# Altium schematic sheet FPGA_FMC.SchDoc
size 420 x 297 mm; EDA_Number: ARTIQ; CompanyName: WUT ISE; Organization: WUT ISE; DocumentNumber: 3; SheetNumber: 3; ModifiedBy: -; Title2: FPGA FMC; ModifiedDate: -
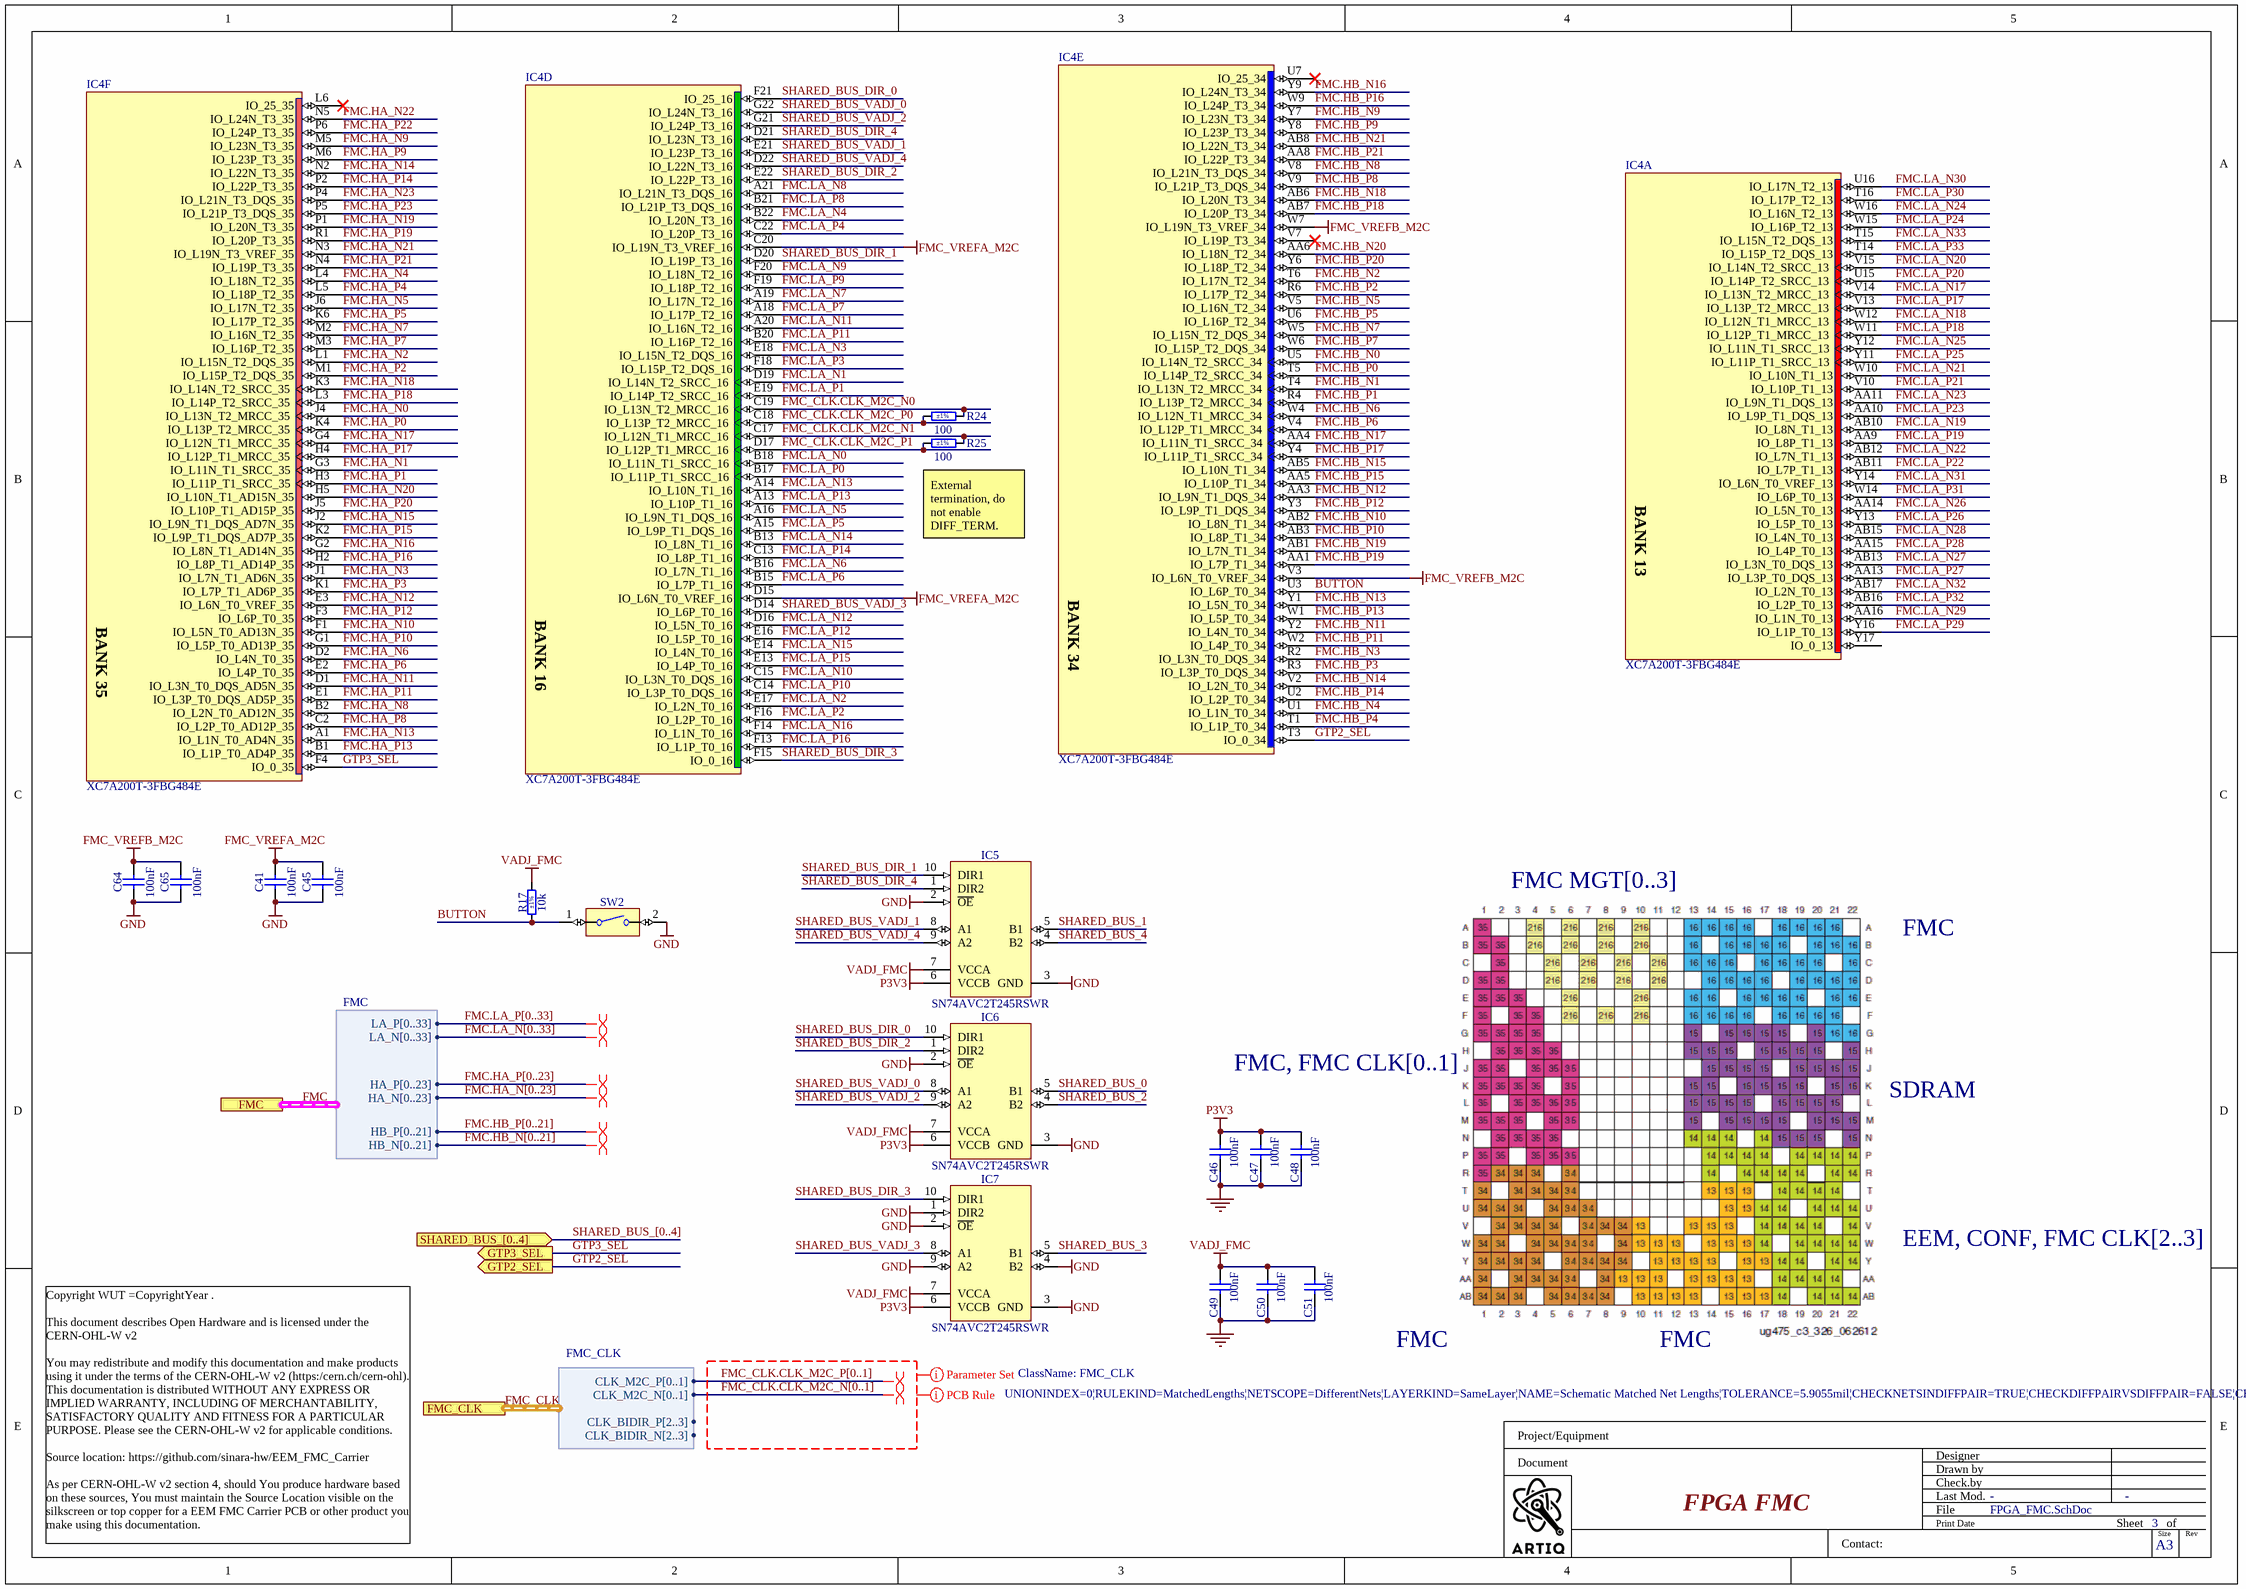
[diagram p0: FPGA_FMC.SchDoc]

## Parts
C41  100nF  [CAPC0603X33N]
C45  100nF  [CAPC0603X33N]
C46  100nF  [CAPC0603X33N]
C47  100nF  [CAPC0603X33N]
C48  100nF  [CAPC0603X33N]
C49  100nF  [CAPC0603X33N]
C50  100nF  [CAPC0603X33N]
C51  100nF  [CAPC0603X33N]
C64  100nF  [CAPC0603X33N]
C65  100nF  [CAPC0603X33N]
IC4  XC7A200T-3FBG484E  [BGA484C100P22X22_2300X2300X254]  (parts A,D,E,F of 10)
IC5  SN74AVC2T245RSWR  [QFN40P140X180X55-10N]
IC6  SN74AVC2T245RSWR  [QFN40P140X180X55-10N]
IC7  SN74AVC2T245RSWR  [QFN40P140X180X55-10N]
R17  10k  Tolerance: ±1%  [RESC1005X40N]
R24  100  Tolerance: ±1%  [RESC0603X28N]
R25  100  Tolerance: ±1%  [RESC0603X28N]
SW2  Switch  [SW_OMRON_B3U-3000PM]  (value not drawn)

## Ports
FMC (harness FMC), FMC_CLK (harness FMC_CLK), GTP2_SEL (out), GTP3_SEL (out), SHARED_BUS_[0..4] (in)

## Harnesses
FMC: LA_P[0..33], LA_N[0..33], HA_P[0..23], HA_N[0..23], HB_P[0..21], HB_N[0..21]
FMC_CLK: CLK_M2C_P[0..1], CLK_M2C_N[0..1], CLK_BIDIR_P[2..3], CLK_BIDIR_N[2..3]

## Nets
FMC_VREFA_M2C: C41.2 C45.2 IC4.C20(IO_L19N_T3_VREF_16) IC4.D15(IO_L6N_T0_VREF_16)
FMC_VREFB_M2C: C64.2 C65.2 IC4.V3(IO_L6N_T0_VREF_34) IC4.W7(IO_L19N_T3_VREF_34)
GND: C41.1 C45.1 C46.1 C47.1 C48.1 C49.1 C50.1 C51.1 C64.1 C65.1 IC5.2(~{OE}) IC5.3(GND) IC6.2(~{OE}) IC6.3(GND) IC7.1(DIR2) IC7.2(~{OE}) IC7.3(GND) IC7.4(B2) IC7.9(A2) SW2.2
P3V3: C46.2 C47.2 C48.2 IC5.6(VCCB) IC6.6(VCCB) IC7.6(VCCB)
VADJ_FMC: C49.2 C50.2 C51.2 IC5.7(VCCA) IC6.7(VCCA) IC7.7(VCCA) R17.2
BUTTON: IC4.U3(IO_L6P_T0_34) R17.1 SW2.1
FMC.HA_N0: IC4.J4(IO_L13N_T2_MRCC_35)
FMC.HA_N1: IC4.G3(IO_L11N_T1_SRCC_35)
FMC.HA_N2: IC4.L1(IO_L15N_T2_DQS_35)
FMC.HA_N3: IC4.J1(IO_L7N_T1_AD6N_35)
FMC.HA_N4: IC4.L4(IO_L18N_T2_35)
FMC.HA_N5: IC4.J6(IO_L17N_T2_35)
FMC.HA_N6: IC4.D2(IO_L4N_T0_35)
FMC.HA_N7: IC4.M2(IO_L16N_T2_35)
FMC.HA_N8: IC4.B2(IO_L2N_T0_AD12N_35)
FMC.HA_N9: IC4.M5(IO_L23N_T3_35)
FMC.HA_N10: IC4.F1(IO_L5N_T0_AD13N_35)
FMC.HA_N11: IC4.D1(IO_L3N_T0_DQS_AD5N_35)
FMC.HA_N12: IC4.E3(IO_L6N_T0_VREF_35)
FMC.HA_N13: IC4.A1(IO_L1N_T0_AD4N_35)
FMC.HA_N14: IC4.N2(IO_L22N_T3_35)
FMC.HA_N15: IC4.J2(IO_L9N_T1_DQS_AD7N_35)
FMC.HA_N16: IC4.G2(IO_L8N_T1_AD14N_35)
FMC.HA_N17: IC4.G4(IO_L12N_T1_MRCC_35)
FMC.HA_N18: IC4.K3(IO_L14N_T2_SRCC_35)
FMC.HA_N19: IC4.P1(IO_L20N_T3_35)
FMC.HA_N20: IC4.H5(IO_L10N_T1_AD15N_35)
FMC.HA_N21: IC4.N3(IO_L19N_T3_VREF_35)
FMC.HA_N22: IC4.N5(IO_L24N_T3_35)
FMC.HA_N23: IC4.P4(IO_L21N_T3_DQS_35)
FMC.HA_P0: IC4.K4(IO_L13P_T2_MRCC_35)
FMC.HA_P1: IC4.H3(IO_L11P_T1_SRCC_35)
FMC.HA_P2: IC4.M1(IO_L15P_T2_DQS_35)
FMC.HA_P3: IC4.K1(IO_L7P_T1_AD6P_35)
FMC.HA_P4: IC4.L5(IO_L18P_T2_35)
FMC.HA_P5: IC4.K6(IO_L17P_T2_35)
FMC.HA_P6: IC4.E2(IO_L4P_T0_35)
FMC.HA_P7: IC4.M3(IO_L16P_T2_35)
FMC.HA_P8: IC4.C2(IO_L2P_T0_AD12P_35)
FMC.HA_P9: IC4.M6(IO_L23P_T3_35)
FMC.HA_P10: IC4.G1(IO_L5P_T0_AD13P_35)
FMC.HA_P11: IC4.E1(IO_L3P_T0_DQS_AD5P_35)
FMC.HA_P12: IC4.F3(IO_L6P_T0_35)
FMC.HA_P13: IC4.B1(IO_L1P_T0_AD4P_35)
FMC.HA_P14: IC4.P2(IO_L22P_T3_35)
FMC.HA_P15: IC4.K2(IO_L9P_T1_DQS_AD7P_35)
FMC.HA_P16: IC4.H2(IO_L8P_T1_AD14P_35)
FMC.HA_P17: IC4.H4(IO_L12P_T1_MRCC_35)
FMC.HA_P18: IC4.L3(IO_L14P_T2_SRCC_35)
FMC.HA_P19: IC4.R1(IO_L20P_T3_35)
FMC.HA_P20: IC4.J5(IO_L10P_T1_AD15P_35)
FMC.HA_P21: IC4.N4(IO_L19P_T3_35)
FMC.HA_P22: IC4.P6(IO_L24P_T3_35)
FMC.HA_P23: IC4.P5(IO_L21P_T3_DQS_35)
FMC.HB_N0: IC4.U5(IO_L14N_T2_SRCC_34)
FMC.HB_N1: IC4.T4(IO_L13N_T2_MRCC_34)
FMC.HB_N2: IC4.T6(IO_L17N_T2_34)
FMC.HB_N3: IC4.R2(IO_L3N_T0_DQS_34)
FMC.HB_N4: IC4.U1(IO_L1N_T0_34)
FMC.HB_N5: IC4.V5(IO_L16N_T2_34)
FMC.HB_N6: IC4.W4(IO_L12N_T1_MRCC_34)
FMC.HB_N7: IC4.W5(IO_L15N_T2_DQS_34)
FMC.HB_N8: IC4.V8(IO_L21N_T3_DQS_34)
FMC.HB_N9: IC4.Y7(IO_L23N_T3_34)
FMC.HB_N10: IC4.AB2(IO_L8N_T1_34)
FMC.HB_N11: IC4.Y2(IO_L4N_T0_34)
FMC.HB_N12: IC4.AA3(IO_L9N_T1_DQS_34)
FMC.HB_N13: IC4.Y1(IO_L5N_T0_34)
FMC.HB_N14: IC4.V2(IO_L2N_T0_34)
FMC.HB_N15: IC4.AB5(IO_L10N_T1_34)
FMC.HB_N16: IC4.Y9(IO_L24N_T3_34)
FMC.HB_N17: IC4.AA4(IO_L11N_T1_SRCC_34)
FMC.HB_N18: IC4.AB6(IO_L20N_T3_34)
FMC.HB_N19: IC4.AB1(IO_L7N_T1_34)
FMC.HB_N20: IC4.AA6(IO_L18N_T2_34)
FMC.HB_N21: IC4.AB8(IO_L22N_T3_34)
FMC.HB_P0: IC4.T5(IO_L14P_T2_SRCC_34)
FMC.HB_P1: IC4.R4(IO_L13P_T2_MRCC_34)
FMC.HB_P2: IC4.R6(IO_L17P_T2_34)
FMC.HB_P3: IC4.R3(IO_L3P_T0_DQS_34)
FMC.HB_P4: IC4.T1(IO_L1P_T0_34)
FMC.HB_P5: IC4.U6(IO_L16P_T2_34)
FMC.HB_P6: IC4.V4(IO_L12P_T1_MRCC_34)
FMC.HB_P7: IC4.W6(IO_L15P_T2_DQS_34)
FMC.HB_P8: IC4.V9(IO_L21P_T3_DQS_34)
FMC.HB_P9: IC4.Y8(IO_L23P_T3_34)
FMC.HB_P10: IC4.AB3(IO_L8P_T1_34)
FMC.HB_P11: IC4.W2(IO_L4P_T0_34)
FMC.HB_P12: IC4.Y3(IO_L9P_T1_DQS_34)
FMC.HB_P13: IC4.W1(IO_L5P_T0_34)
FMC.HB_P14: IC4.U2(IO_L2P_T0_34)
FMC.HB_P15: IC4.AA5(IO_L10P_T1_34)
FMC.HB_P16: IC4.W9(IO_L24P_T3_34)
FMC.HB_P17: IC4.Y4(IO_L11P_T1_SRCC_34)
FMC.HB_P18: IC4.AB7(IO_L20P_T3_34)
FMC.HB_P19: IC4.AA1(IO_L7P_T1_34)
FMC.HB_P20: IC4.Y6(IO_L18P_T2_34)
FMC.HB_P21: IC4.AA8(IO_L22P_T3_34)
FMC.LA_N0: IC4.B18(IO_L11N_T1_SRCC_16)
FMC.LA_N1: IC4.D19(IO_L14N_T2_SRCC_16)
FMC.LA_N2: IC4.E17(IO_L2N_T0_16)
FMC.LA_N3: IC4.E18(IO_L15N_T2_DQS_16)
FMC.LA_N4: IC4.B22(IO_L20N_T3_16)
FMC.LA_N5: IC4.A16(IO_L9N_T1_DQS_16)
FMC.LA_N6: IC4.B16(IO_L7N_T1_16)
FMC.LA_N7: IC4.A19(IO_L17N_T2_16)
FMC.LA_N8: IC4.A21(IO_L21N_T3_DQS_16)
FMC.LA_N9: IC4.F20(IO_L18N_T2_16)
FMC.LA_N10: IC4.C15(IO_L3N_T0_DQS_16)
FMC.LA_N11: IC4.A20(IO_L16N_T2_16)
FMC.LA_N12: IC4.D16(IO_L5N_T0_16)
FMC.LA_N13: IC4.A14(IO_L10N_T1_16)
FMC.LA_N14: IC4.B13(IO_L8N_T1_16)
FMC.LA_N15: IC4.E14(IO_L4N_T0_16)
FMC.LA_N16: IC4.F14(IO_L1N_T0_16)
FMC.LA_N17: IC4.V14(IO_L13N_T2_MRCC_13)
FMC.LA_N18: IC4.W12(IO_L12N_T1_MRCC_13)
FMC.LA_N19: IC4.AB10(IO_L8N_T1_13)
FMC.LA_N20: IC4.V15(IO_L14N_T2_SRCC_13)
FMC.LA_N21: IC4.W10(IO_L10N_T1_13)
FMC.LA_N22: IC4.AB12(IO_L7N_T1_13)
FMC.LA_N23: IC4.AA11(IO_L9N_T1_DQS_13)
FMC.LA_N24: IC4.W16(IO_L16N_T2_13)
FMC.LA_N25: IC4.Y12(IO_L11N_T1_SRCC_13)
FMC.LA_N26: IC4.AA14(IO_L5N_T0_13)
FMC.LA_N27: IC4.AB13(IO_L3N_T0_DQS_13)
FMC.LA_N28: IC4.AB15(IO_L4N_T0_13)
FMC.LA_N29: IC4.AA16(IO_L1N_T0_13)
FMC.LA_N30: IC4.U16(IO_L17N_T2_13)
FMC.LA_N31: IC4.Y14(IO_L6N_T0_VREF_13)
FMC.LA_N32: IC4.AB17(IO_L2N_T0_13)
FMC.LA_N33: IC4.T15(IO_L15N_T2_DQS_13)
FMC.LA_P0: IC4.B17(IO_L11P_T1_SRCC_16)
FMC.LA_P1: IC4.E19(IO_L14P_T2_SRCC_16)
FMC.LA_P2: IC4.F16(IO_L2P_T0_16)
FMC.LA_P3: IC4.F18(IO_L15P_T2_DQS_16)
FMC.LA_P4: IC4.C22(IO_L20P_T3_16)
FMC.LA_P5: IC4.A15(IO_L9P_T1_DQS_16)
FMC.LA_P6: IC4.B15(IO_L7P_T1_16)
FMC.LA_P7: IC4.A18(IO_L17P_T2_16)
FMC.LA_P8: IC4.B21(IO_L21P_T3_DQS_16)
FMC.LA_P9: IC4.F19(IO_L18P_T2_16)
FMC.LA_P10: IC4.C14(IO_L3P_T0_DQS_16)
FMC.LA_P11: IC4.B20(IO_L16P_T2_16)
FMC.LA_P12: IC4.E16(IO_L5P_T0_16)
FMC.LA_P13: IC4.A13(IO_L10P_T1_16)
FMC.LA_P14: IC4.C13(IO_L8P_T1_16)
FMC.LA_P15: IC4.E13(IO_L4P_T0_16)
FMC.LA_P16: IC4.F13(IO_L1P_T0_16)
FMC.LA_P17: IC4.V13(IO_L13P_T2_MRCC_13)
FMC.LA_P18: IC4.W11(IO_L12P_T1_MRCC_13)
FMC.LA_P19: IC4.AA9(IO_L8P_T1_13)
FMC.LA_P20: IC4.U15(IO_L14P_T2_SRCC_13)
FMC.LA_P21: IC4.V10(IO_L10P_T1_13)
FMC.LA_P22: IC4.AB11(IO_L7P_T1_13)
FMC.LA_P23: IC4.AA10(IO_L9P_T1_DQS_13)
FMC.LA_P24: IC4.W15(IO_L16P_T2_13)
FMC.LA_P25: IC4.Y11(IO_L11P_T1_SRCC_13)
FMC.LA_P26: IC4.Y13(IO_L5P_T0_13)
FMC.LA_P27: IC4.AA13(IO_L3P_T0_DQS_13)
FMC.LA_P28: IC4.AA15(IO_L4P_T0_13)
FMC.LA_P29: IC4.Y16(IO_L1P_T0_13)
FMC.LA_P30: IC4.T16(IO_L17P_T2_13)
FMC.LA_P31: IC4.W14(IO_L6P_T0_13)
FMC.LA_P32: IC4.AB16(IO_L2P_T0_13)
FMC.LA_P33: IC4.T14(IO_L15P_T2_DQS_13)
FMC_CLK.CLK_M2C_N0: IC4.C19(IO_L13N_T2_MRCC_16) R24.2
FMC_CLK.CLK_M2C_N1: IC4.C17(IO_L12N_T1_MRCC_16) R25.2
FMC_CLK.CLK_M2C_P0: IC4.C18(IO_L13P_T2_MRCC_16) R24.1
FMC_CLK.CLK_M2C_P1: IC4.D17(IO_L12P_T1_MRCC_16) R25.1
GTP2_SEL: IC4.T3(IO_0_34) ; port GTP2_SEL
GTP3_SEL: IC4.F4(IO_0_35) ; port GTP3_SEL
SHARED_BUS_0: IC6.5(B1)
SHARED_BUS_1: IC5.5(B1)
SHARED_BUS_2: IC6.4(B2)
SHARED_BUS_3: IC7.5(B1)
SHARED_BUS_4: IC5.4(B2)
SHARED_BUS_DIR_0: IC4.F21(IO_25_16) IC6.10(DIR1)
SHARED_BUS_DIR_1: IC4.D20(IO_L19P_T3_16) IC5.10(DIR1)
SHARED_BUS_DIR_2: IC4.E22(IO_L22P_T3_16) IC6.1(DIR2)
SHARED_BUS_DIR_3: IC4.F15(IO_0_16) IC7.10(DIR1)
SHARED_BUS_DIR_4: IC4.D21(IO_L23N_T3_16) IC5.1(DIR2)
SHARED_BUS_VADJ_0: IC4.G22(IO_L24N_T3_16) IC6.8(A1)
SHARED_BUS_VADJ_1: IC4.E21(IO_L23P_T3_16) IC5.8(A1)
SHARED_BUS_VADJ_2: IC4.G21(IO_L24P_T3_16) IC6.9(A2)
SHARED_BUS_VADJ_3: IC4.D14(IO_L6P_T0_16) IC7.8(A1)
SHARED_BUS_VADJ_4: IC4.D22(IO_L22N_T3_16) IC5.9(A2)

Not connected (* = marked no-connect by the designer): IC4 L6(IO_25_35)* U7(IO_25_34)* V7(IO_L19P_T3_34)* Y17(IO_0_13)

## Buses and harness runs
bus FMC.HA_N[0..23]
bus FMC.HA_P[0..23]
bus FMC.HB_N[0..21]
bus FMC.HB_P[0..21]
bus FMC.LA_N[0..33]
bus FMC.LA_P[0..33]
bus FMC_CLK.CLK_M2C_N[0..1]
bus FMC_CLK.CLK_M2C_P[0..1]
bus SHARED_BUS_[0..4] = port SHARED_BUS_[0..4]
harness FMC = port FMC
harness FMC_CLK = port FMC_CLK

## Layout directives
differential pair; differential pair class FMC_LA; differential pair class Diff_100Ohm: (no net found under the mark)
differential pair; differential pair class FMC_HA; differential pair class Diff_100Ohm: (no net found under the mark)
differential pair; differential pair class FMC_HB; differential pair class Diff_100Ohm: (no net found under the mark)
net class FMC_CLK: FMC_CLK.CLK_M2C_N[0..1], FMC_CLK.CLK_M2C_P[0..1]
rule Matched Net Lengths [Delay Tolerance = 11ps]: FMC_CLK.CLK_M2C_N[0..1], FMC_CLK.CLK_M2C_P[0..1]
differential pair; differential pair class Diff_100Ohm: FMC_CLK.CLK_M2C_N[0..1], FMC_CLK.CLK_M2C_P[0..1]

## Notes on the sheet
- (near R25) External termination, do not enable DIFF_TERM.
- FMC MGT[0..3]
- FMC
- FMC, FMC CLK[0..1]
- SDRAM
- EEM, CONF, FMC CLK[2..3]
- Project/Equipment
- Document
- Designer
- Drawn by
- Check.by
- Copyright WUT =CopyrightYear .
  This document describes Open Hardware and is licensed under the CERN-OHL-W v2
  You may redistribute and modify this documentation and make products using it under the terms of the CERN-OHL-W v2 (https:/cern.ch/cern-ohl). This documentation is distributed WITHOUT ANY EXPRESS OR IMPLIED WARRANTY, INCLUDING OF MERCHANTABILITY, SATISFACTORY QUALITY AND FITNESS FOR A PARTICULAR PURPOSE. Please see the CERN-OHL-W v2 for applicable conditions.
  Source location: https://github.com/sinara-hw/EEM_FMC_Carrier
  As per CERN-OHL-W v2 section 4, should You produce hardware based on these sources, You must maintain the Source Location visible on the silkscreen or top copper for a EEM FMC Carrier PCB or other product you make using this documentation.
- Contact:
- File
- Last Mod.
- Print Date
- Sheet
- Size
- A3
- of
- Rev
- (in symbol XC7A200T-3FBG484E, part A) BANK 13
- (in symbol XC7A200T-3FBG484E, part D) BANK 16
- (in symbol XC7A200T-3FBG484E, part E) BANK 34
- (in symbol XC7A200T-3FBG484E, part F) BANK 35

## Library data of the parts
C41 C45 C64 C65 = CC0201_100NF_6.3V_10%_X5R: Non-polarised capacitor; Part Description: SMD Multilayer Chip Ceramic Capacitor; Manufacturer: GENERIC; Manufacturer1 Part Number: 02016D104KAT2A; Voltage: 6.3V; TC: X5R; Tolerance: ±10%; Table: Capacitors SMD; Part Number: CC0201_100NF_6.3V_10%_X5R; Component Kind: Standard; Component Type: Standard; Pin Count: 2; Value: 100nF; Status: Not Recommended; Manufacturer Part Number: CC0201_100NF_6.3V_10%_X5R; Case: 0201; Mounted: Yes; Socket: No; SMD: Yes; Manufacturer1 Example: AVX; Manufacturer1 ComponentHeight: 0.33mm; HelpURL: \\cern.ch\dfs\Applications\Altium\Datasheets\CC0201_X5R_AVX.pdf; Author: CERN DEM JLC; CreateDate: 2007-12-03; LatestRevisionDate: 2007-12-03
C46-C51 = CC0201_100NF_6.3V_10%_X5R: Non-polarised capacitor; Part Description: SMD Multilayer Chip Ceramic Capacitor; Manufacturer: GENERIC; Manufacturer1 Part Number: 02016D104KAT2A; Voltage: 6.3V; TC: X5R; Tolerance: ±10%; Part Number: CC0201_100NF_6.3V_10%_X5R; Component Kind: Standard; Component Type: Standard; Pin Count: 2; Value: 100nF; Status: Not Recommended; Manufacturer Part Number: CC0201_100NF_6.3V_10%_X5R; Case: 0201; Mounted: Yes; Socket: No; SMD: Yes; Sense: No; Manufacturer1 Example: AVX; Manufacturer1 ComponentHeight: 0.33mm; HelpURL: \\cern.ch\dfs\Applications\Altium\Datasheets\CC0201_X5R_AVX.pdf; Author: CERN DEM JLC; CreateDate: 2007-12-03; LatestRevisionDate: 2007-12-03
IC4 = XC7A200T-3FBG484E: Artix-7 FPGA, 285 User I/Os, 4 GTP, 484-Ball BGA, Pb-Free; Manufacturer Part Number: XC7A200T-3FBG484E; Device: XC7A200T-3FBG484E
IC5-IC7 = SN74AVC2T245RSWR: Dual-Bit Dual-Supply Bus Transceiver With Configurable Voltage Translation and 3-State Outputs; Manufacturer: TEXAS INSTRUMENTS; PressFit: No; Bonding: No; Part Number: SN74AVC2T245RSWR; Component Kind: Standard; Component Type: Standard; Device: SN74AVC2T245RSWR; PackageDescription: QFN, 0.40mm Pitch, Rect.;10 Pin, 1.80mm L X 1.40mm W X 0.55mm H Body, IPC Medium Density; Status: Not Recommended; Part Description: Dual-Bit Dual-Supply Bus Transceiver With Configurable Voltage Translation and 3-State Outputs; Manufacturer Part Number: SN74AVC2T245RSWR; Pin Count: 10; Case: QFN10; Mounted: Yes; Socket: No; SMD: Yes; Sense: No; ComponentHeight: 0.55mm; Author: CERN DEM JLC; HelpURL: \\cern.ch\dfs\Applications\Altium\Datasheets\SN74AVC2T245RSWR.pdf; CreateDate: 07.07.2014; LatestRevisionDate: 30.03.2017
R17 = R0402_10K_1%_0.0625W_100PPM: Resistor - 1%; Part Description: General Purpose Thick Film Chip Resistor; Manufacturer: GENERIC; Manufacturer1 Part Number: 232270671003L; TC: ±100ppm/°C; PressFit: No; Part Number: R0402_10K_1%_0.0625W_100PPM; Component Kind: Standard; Component Type: Standard; Pin Count: 2; Value: 10k; Status: Not Recommended; Power: 0.0625W; Manufacturer Part Number: R0402_10K_1%_0.0625W_100PPM; Case: 0402; Mounted: Yes; Sense: No; Socket: No; SMD: Yes; Manufacturer1 Example: YAGEO PHYCOMP; Manufacturer1 ComponentHeight: 0.4mm; HelpURL: \\cern.ch\dfs\Applications\Altium\Datasheets\R0402_Phycomp_RC0402.pdf; Author: CERN DEM JLC; CreateDate: 2007-12-03; LatestRevisionDate: 2012-10-17
R24 R25 = R0201_100R_1%_0.05W_200PPM: Resistor - 1%; Part Description: Thick Film Chip Resistor; Manufacturer: GENERIC; Manufacturer1 Part Number: CRCW0201100RFNED; Power: 0.05W; TC: ±200ppm/°C; PressFit: No; Part Number: R0201_100R_1%_0.05W_200PPM; Component Kind: Standard; Component Type: Standard; Pin Count: 2; Value: 100; Status: Not Recommended; Manufacturer Part Number: R0201_100R_1%_0.05W_200PPM; Case: 0201; Mounted: Yes; Sense: No; Socket: No; SMD: Yes; Manufacturer1 Example: VISHAY; Manufacturer1 ComponentHeight: 0.27mm; HelpURL: \\cern.ch\dfs\Applications\Altium\Datasheets\R0201_VISHAY_CRCW e3.pdf; Author: CERN DEM JLC; CreateDate: 2014-11-13; LatestRevisionDate: 2014-11-13
SW2 = SW_OMRON_B3U-3000PM: 1 Ways SPST DIP Switch; Part Description: Ultra-small Surface-mounting Tactile Switche with High Contact Reliability, Side-actuated, Contact Rating 50mA 12VDC; Manufacturer: OMRON; PressFit: No; Sense Comment: Non-washable; Part Number: SW_OMRON_B3U-3000PM; Component Kind: Standard; Component Type: Standard; Pin Count: 2; PackageDescription: Body 3.2x4.0mm, SPST Surface-Mounting Tactile Switch with Side Actuator (B3U Series); Family: Switch; Mounted: Yes; Socket: No; SMD: Yes; Sense: Yes; Status: None; Manufacturer Part Number: B3U-3000PM; ComponentHeight: 1.35mm; HelpURL: \\cern.ch\dfs\Applications\Altium\Datasheets\SW_OMRON_B3U.pdf; Author: CERN DEM HF; CreateDate: 2022-10-04; LatestRevisionDate: 2022-10-04